# EAGLE design motors_motherBoard (EAGLE 8.2.0)
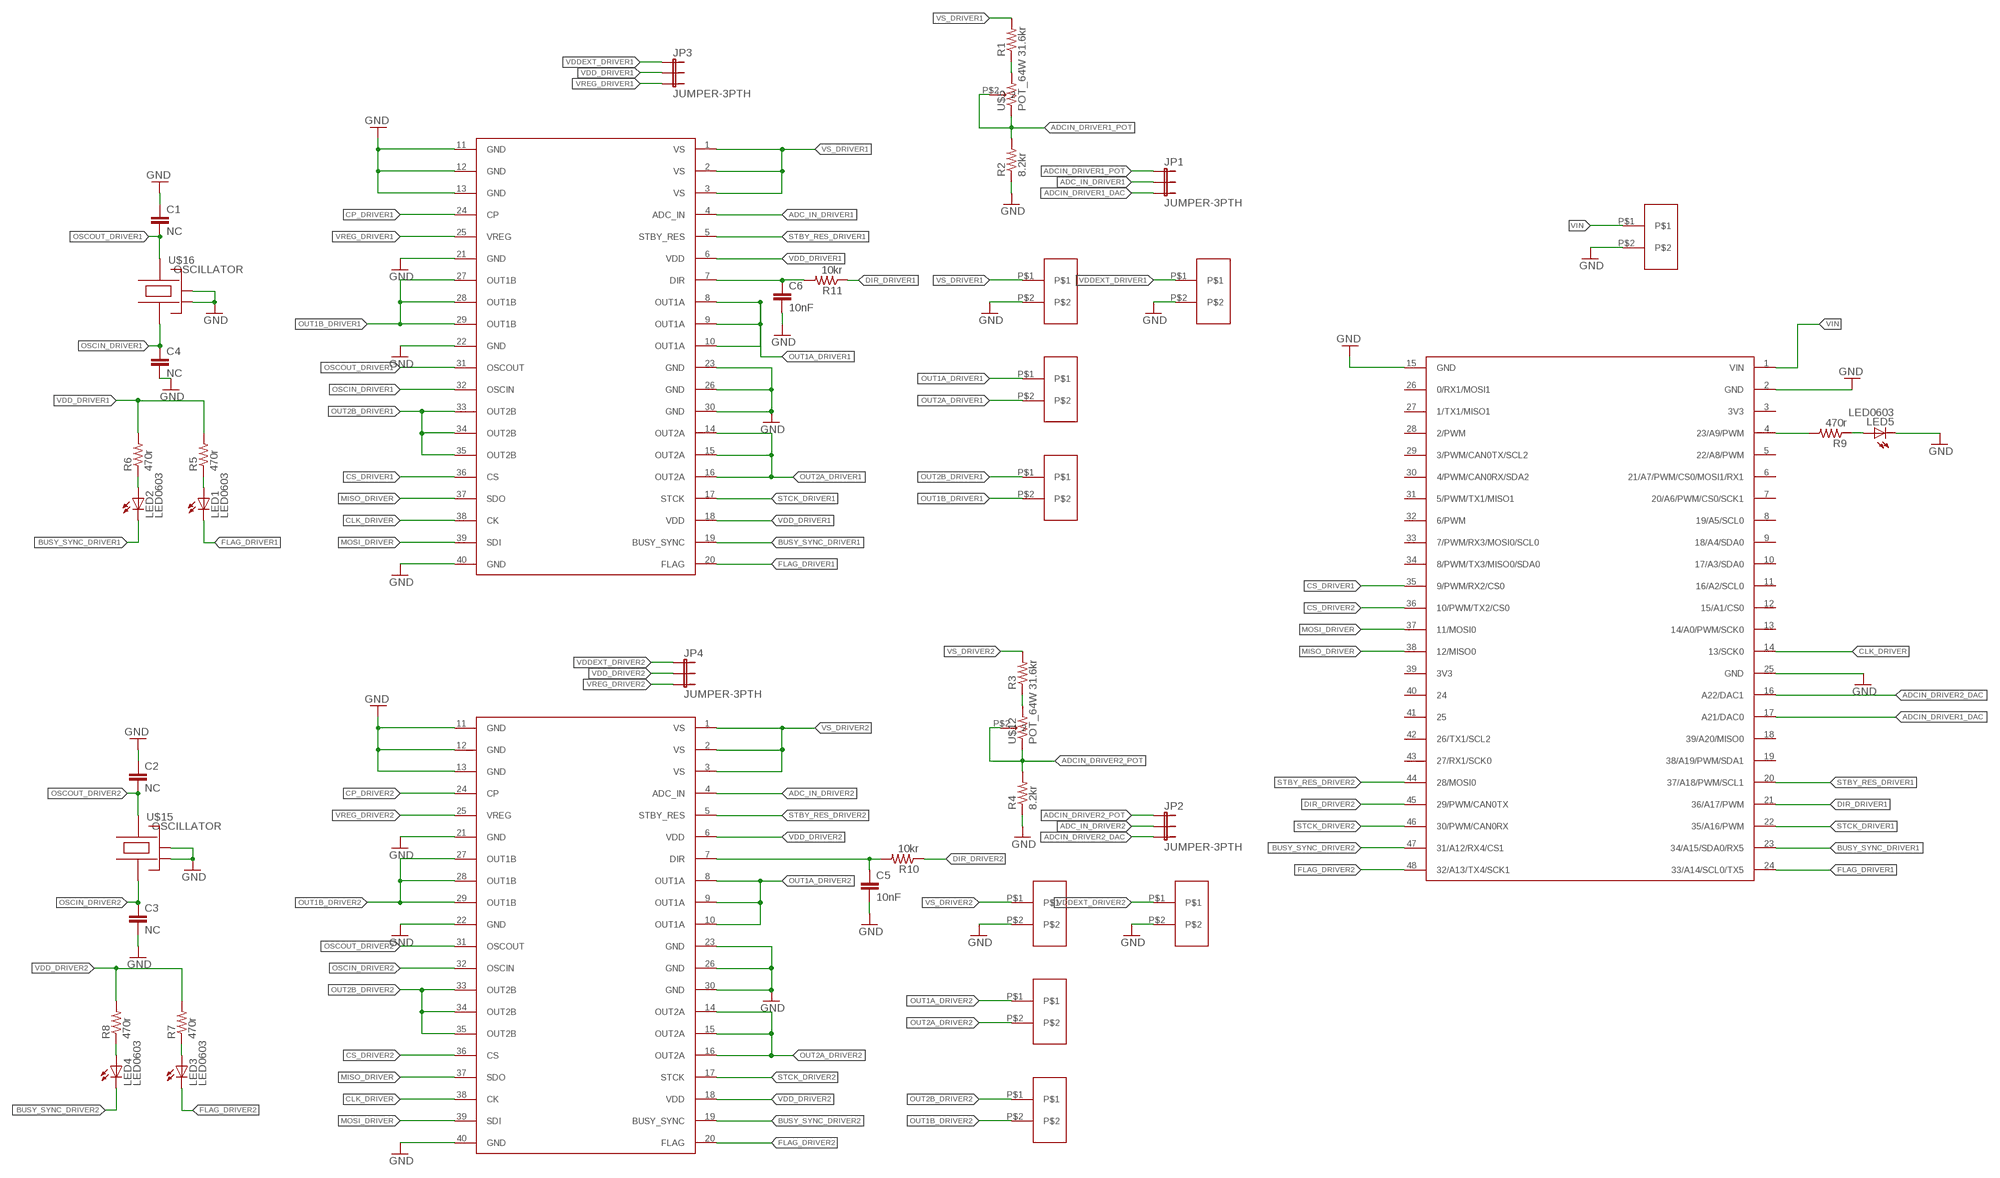
[diagram p0: schematic, sheet 1]

## Parts
C1  NC  CAP0603  [0603-CAP]
C2  NC  CAP0603  [0603-CAP]
C3  NC  CAP0603  [0603-CAP]
C4  NC  CAP0603  [0603-CAP]
C5  10nF  CAP0603  [0603-CAP]
C6  10nF  CAP0603  [0603-CAP]
JP1  JUMPER-3PTH  [1X03]
JP2  JUMPER-3PTH  [1X03]
JP3  JUMPER-3PTH  [1X03]
JP4  JUMPER-3PTH  [1X03]
LED1  LED0603  [0603-LED]
LED2  LED0603  [0603-LED]
LED3  LED0603  [0603-LED]
LED4  LED0603  [0603-LED]
LED5  LED0603  [0603-LED]
R1  31.6kr  RESISTOR0603-RES  [0603-RES]
R2  8.2kr  RESISTOR0603-RES  [0603-RES]
R3  31.6kr  RESISTOR0603-RES  [0603-RES]
R4  8.2kr  RESISTOR0603-RES  [0603-RES]
R5  470r  RESISTOR0603-RES  [0603-RES]
R6  470r  RESISTOR0603-RES  [0603-RES]
R7  470r  RESISTOR0603-RES  [0603-RES]
R8  470r  RESISTOR0603-RES  [0603-RES]
R9  470r  RESISTOR0603-RES  [0603-RES]
R10  10kr  RESISTOR0603-RES  [0603-RES]
R11  10kr  RESISTOR0603-RES  [0603-RES]
U$1  MOTORDRIVER_BASE_ADAPTER  [MOTORDRIVER_BASE_ADAPTER]
U$2  MOTORDRIVER_BASE_ADAPTER  [MOTORDRIVER_BASE_ADAPTER]
U$3  TEENSY_BASE_ADAPTER  [TEENSY_BASE_ADAPTER]
U$4  SCREW_CON_2POLES  [SCREW_CON_2POLES]
U$5  POT_64W  [POT_64W]
U$6  SCREW_CON_2POLES  [SCREW_CON_2POLES]
U$7  SCREW_CON_2POLES  [SCREW_CON_2POLES]
U$8  SCREW_CON_2POLES  [SCREW_CON_2POLES]
U$9  SCREW_CON_2POLES  [SCREW_CON_2POLES]
U$10  SCREW_CON_2POLES  [SCREW_CON_2POLES]
U$11  SCREW_CON_2POLES  [SCREW_CON_2POLES]
U$12  POT_64W  [POT_64W]
U$13  SCREW_CON_2POLES  [SCREW_CON_2POLES]
U$14  SCREW_CON_2POLES  [SCREW_CON_2POLES]
U$15  OSCILLATOR  [OSCILLATOR_3.2X2.5]
U$16  OSCILLATOR  [OSCILLATOR_3.2X2.5]

## Nets
ADC_IN_DRIVER1: JP1.2 U$2.4(ADC_IN)
ADC_IN_DRIVER2: JP2.2 U$1.4(ADC_IN)
ADCIN_DRIVER1_DAC: JP1.3 U$3.17(A21/DAC0)
ADCIN_DRIVER1_POT: JP1.1 R2.2 U$5.P$1 U$5.P$2
ADCIN_DRIVER2_DAC: JP2.3 U$3.16(A22/DAC1)
ADCIN_DRIVER2_POT: JP2.1 R4.2 U$12.P$1 U$12.P$2
BUSY_SYNC_DRIVER1: LED2.C U$2.19(BUSY_SYNC) U$3.23(34/A15/SDA0/RX5)
BUSY_SYNC_DRIVER2: LED4.C U$1.19(BUSY_SYNC) U$3.47(31/A12/RX4/CS1)
CLK_DRIVER: U$1.38(CK) U$2.38(CK) U$3.14(13/SCK0)
CP_DRIVER1: U$2.24(CP)
CP_DRIVER2: U$1.24(CP)
CS_DRIVER1: U$2.36(CS) U$3.35(9/PWM/RX2/CS0)
CS_DRIVER2: U$1.36(CS) U$3.36(10/PWM/TX2/CS0)
DIR_DRIVER1: R11.1 U$3.21(36/A17/PWM)
DIR_DRIVER2: R10.1 U$3.45(29/PWM/CAN0TX)
FLAG_DRIVER1: LED1.C U$2.20(FLAG) U$3.24(33/A14/SCL0/TX5)
FLAG_DRIVER2: LED3.C U$1.20(FLAG) U$3.48(32/A13/TX4/SCK1)
GND: C1.P$1 C2.P$1 C3.P$2 C4.P$2 C5.P$2 C6.P$2 LED5.C R2.1 R4.1 U$1.11(GND) U$1.12(GND) U$1.13(GND) U$1.21(GND) U$1.22(GND) U$1.23(GND) U$1.26(GND) U$1.30(GND) U$1.40(GND) U$2.11(GND) U$2.12(GND) U$2.13(GND) U$2.21(GND) U$2.22(GND) U$2.23(GND) U$2.26(GND) U$2.30(GND) U$2.40(GND) U$3.2(GND) U$3.15(GND) U$3.25(GND) U$7.P$2 U$9.P$2 U$11.P$2 U$13.P$2 U$14.P$2 U$15.2(GND) U$15.4(GND) U$16.2(GND) U$16.4(GND)
MISO_DRIVER: U$1.37(SDO) U$2.37(SDO) U$3.38(12/MISO0)
MOSI_DRIVER: U$1.39(SDI) U$2.39(SDI) U$3.37(11/MOSI0)
N$1: R3.1 U$12.P$3
N$2: R1.1 U$5.P$3
N$3: LED2.A R6.1
N$4: LED1.A R5.1
N$5: LED4.A R8.1
N$6: LED3.A R7.1
N$7: LED5.A R9.1
N$8: R9.2 U$3.4(23/A9/PWM)
N$9: C6.P$1 R11.2 U$2.7(DIR)
N$10: C5.P$1 R10.2 U$1.7(DIR)
OSCIN_DRIVER1: C4.P$1 U$2.32(OSCIN) U$16.1
OSCIN_DRIVER2: C3.P$1 U$1.32(OSCIN) U$15.1
OSCOUT_DRIVER1: C1.P$2 U$2.31(OSCOUT) U$16.3
OSCOUT_DRIVER2: C2.P$2 U$1.31(OSCOUT) U$15.3
OUT1A_DRIVER1: U$2.8(OUT1A) U$2.9(OUT1A) U$2.10(OUT1A) U$6.P$1
OUT1A_DRIVER2: U$1.8(OUT1A) U$1.9(OUT1A) U$1.10(OUT1A) U$4.P$1
OUT1B_DRIVER1: U$2.27(OUT1B) U$2.28(OUT1B) U$2.29(OUT1B) U$8.P$2
OUT1B_DRIVER2: U$1.27(OUT1B) U$1.28(OUT1B) U$1.29(OUT1B) U$10.P$2
OUT2A_DRIVER1: U$2.14(OUT2A) U$2.15(OUT2A) U$2.16(OUT2A) U$6.P$2
OUT2A_DRIVER2: U$1.14(OUT2A) U$1.15(OUT2A) U$1.16(OUT2A) U$4.P$2
OUT2B_DRIVER1: U$2.33(OUT2B) U$2.34(OUT2B) U$2.35(OUT2B) U$8.P$1
OUT2B_DRIVER2: U$1.33(OUT2B) U$1.34(OUT2B) U$1.35(OUT2B) U$10.P$1
STBY_RES_DRIVER1: U$2.5(STBY_RES) U$3.20(37/A18/PWM/SCL1)
STBY_RES_DRIVER2: U$1.5(STBY_RES) U$3.44(28/MOSI0)
STCK_DRIVER1: U$2.17(STCK) U$3.22(35/A16/PWM)
STCK_DRIVER2: U$1.17(STCK) U$3.46(30/PWM/CAN0RX)
VDD_DRIVER1: JP3.2 R5.2 R6.2 U$2.6(VDD) U$2.18(VDD)
VDD_DRIVER2: JP4.2 R7.2 R8.2 U$1.6(VDD) U$1.18(VDD)
VDDEXT_DRIVER1: JP3.1 U$13.P$1
VDDEXT_DRIVER2: JP4.1 U$11.P$1
VIN: U$3.1(VIN) U$14.P$1
VREG_DRIVER1: JP3.3 U$2.25(VREG)
VREG_DRIVER2: JP4.3 U$1.25(VREG)
VS_DRIVER1: R1.2 U$2.1(VS) U$2.2(VS) U$2.3(VS) U$7.P$1
VS_DRIVER2: R3.2 U$1.1(VS) U$1.2(VS) U$1.3(VS) U$9.P$1
Unconnected: U$3.3(3V3) U$3.5(22/A8/PWM) U$3.6(21/A7/PWM/CS0/MOSI1/RX1) U$3.7(20/A6/PWM/CS0/SCK1) U$3.8(19/A5/SCL0) U$3.9(18/A4/SDA0) U$3.10(17/A3/SDA0) U$3.11(16/A2/SCL0) U$3.12(15/A1/CS0) U$3.13(14/A0/PWM/SCK0) U$3.18(39/A20/MISO0) U$3.19(38/A19/PWM/SDA1) U$3.26(0/RX1/MOSI1) U$3.27(1/TX1/MISO1) U$3.28(2/PWM) U$3.29(3/PWM/CAN0TX/SCL2) U$3.30(4/PWM/CAN0RX/SDA2) U$3.31(5/PWM/TX1/MISO1) U$3.32(6/PWM) U$3.33(7/PWM/RX3/MOSI0/SCL0) U$3.34(8/PWM/TX3/MISO0/SDA0) U$3.39(3V3) U$3.40 U$3.41 U$3.42(26/TX1/SCL2) U$3.43(27/RX1/SCK0)

## Library data of the parts
C1-C6 = Usefull_ICs:CAP: Capacitor Standard 0603 ceramic capacitor, and 0.1" leaded capacitor.
JP1-JP4 = Usefull_ICs:JUMPER-3
LED1-LED5 = Usefull_ICs:LED: LEDs Standard schematic elements and footprints for 5mm, 3mm, 1206, and 0603 sized LEDs. 5mm - Spark Fun Electronics SKU : COM-00529 (and others)
R1-R11 = Usefull_ICs:RESISTOR: Resistor Basic schematic elements and footprints for 0603, 1206, and PTH 1/10th watt (small) resistors.
U$1 U$2 = Usefull_ICs:MOTORDRIVER_BASE_ADAPTER
U$3 = Usefull_ICs:TEENSY_BASE_ADAPTER
U$4 U$6-U$11 U$13 U$14 = Usefull_ICs:SCREW_CON_2POLES
U$5 U$12 = Usefull_ICs:POT_64W
U$15 U$16 = Usefull_ICs:OSCILLATOR

## Board
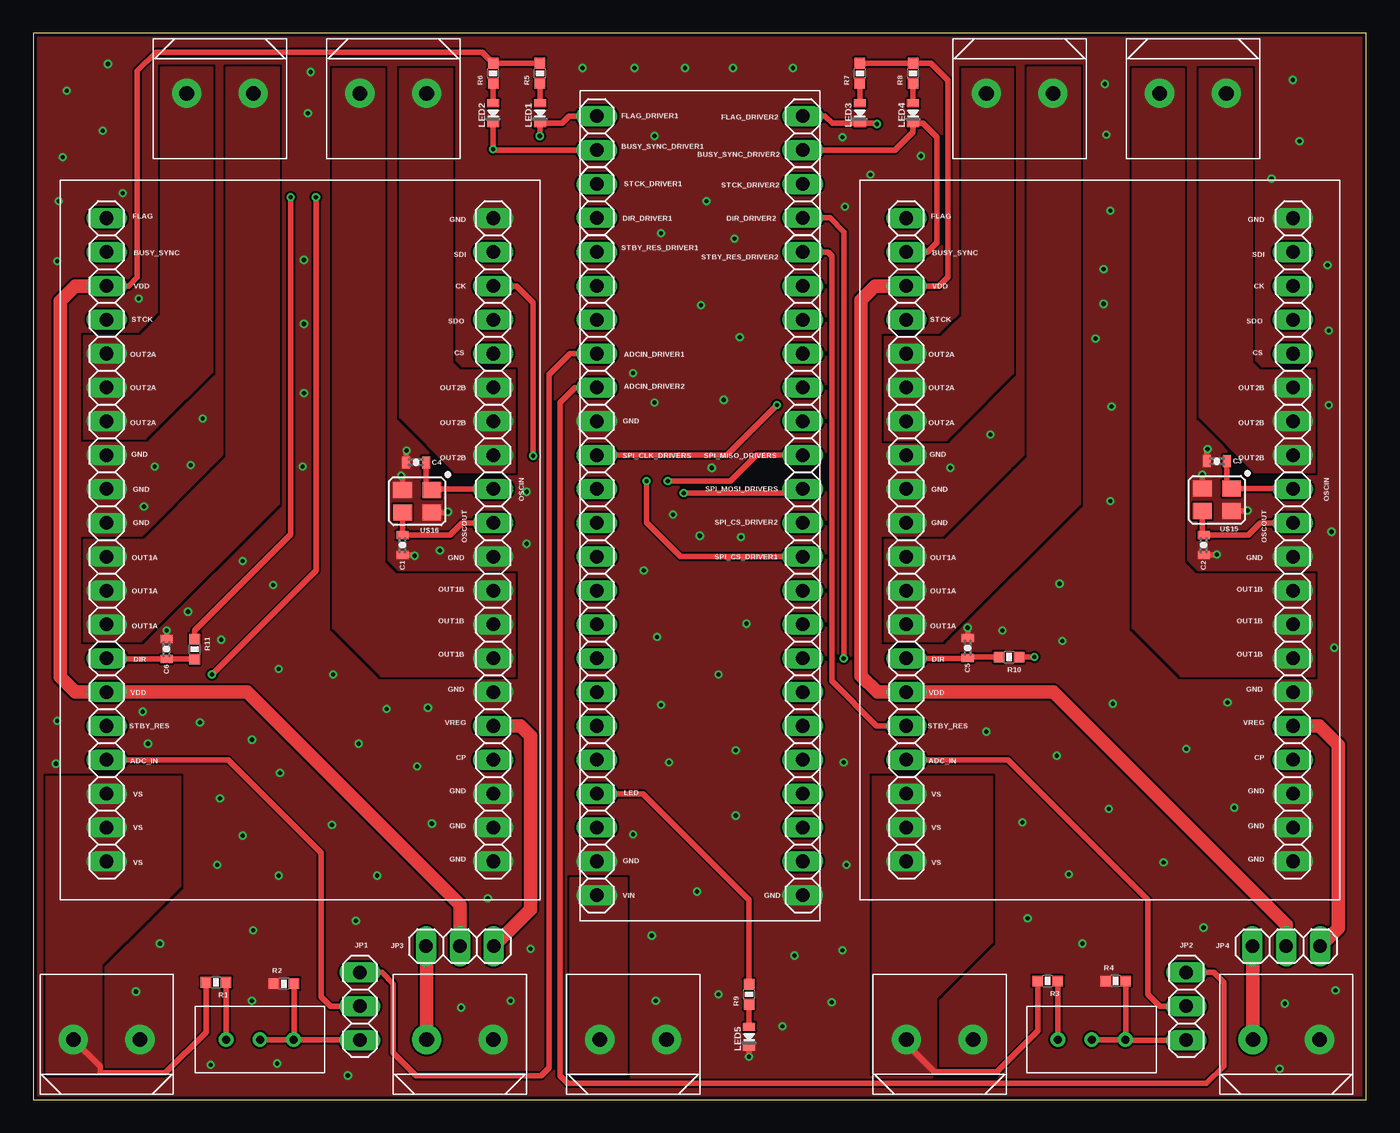
[diagram p1: board, top side]
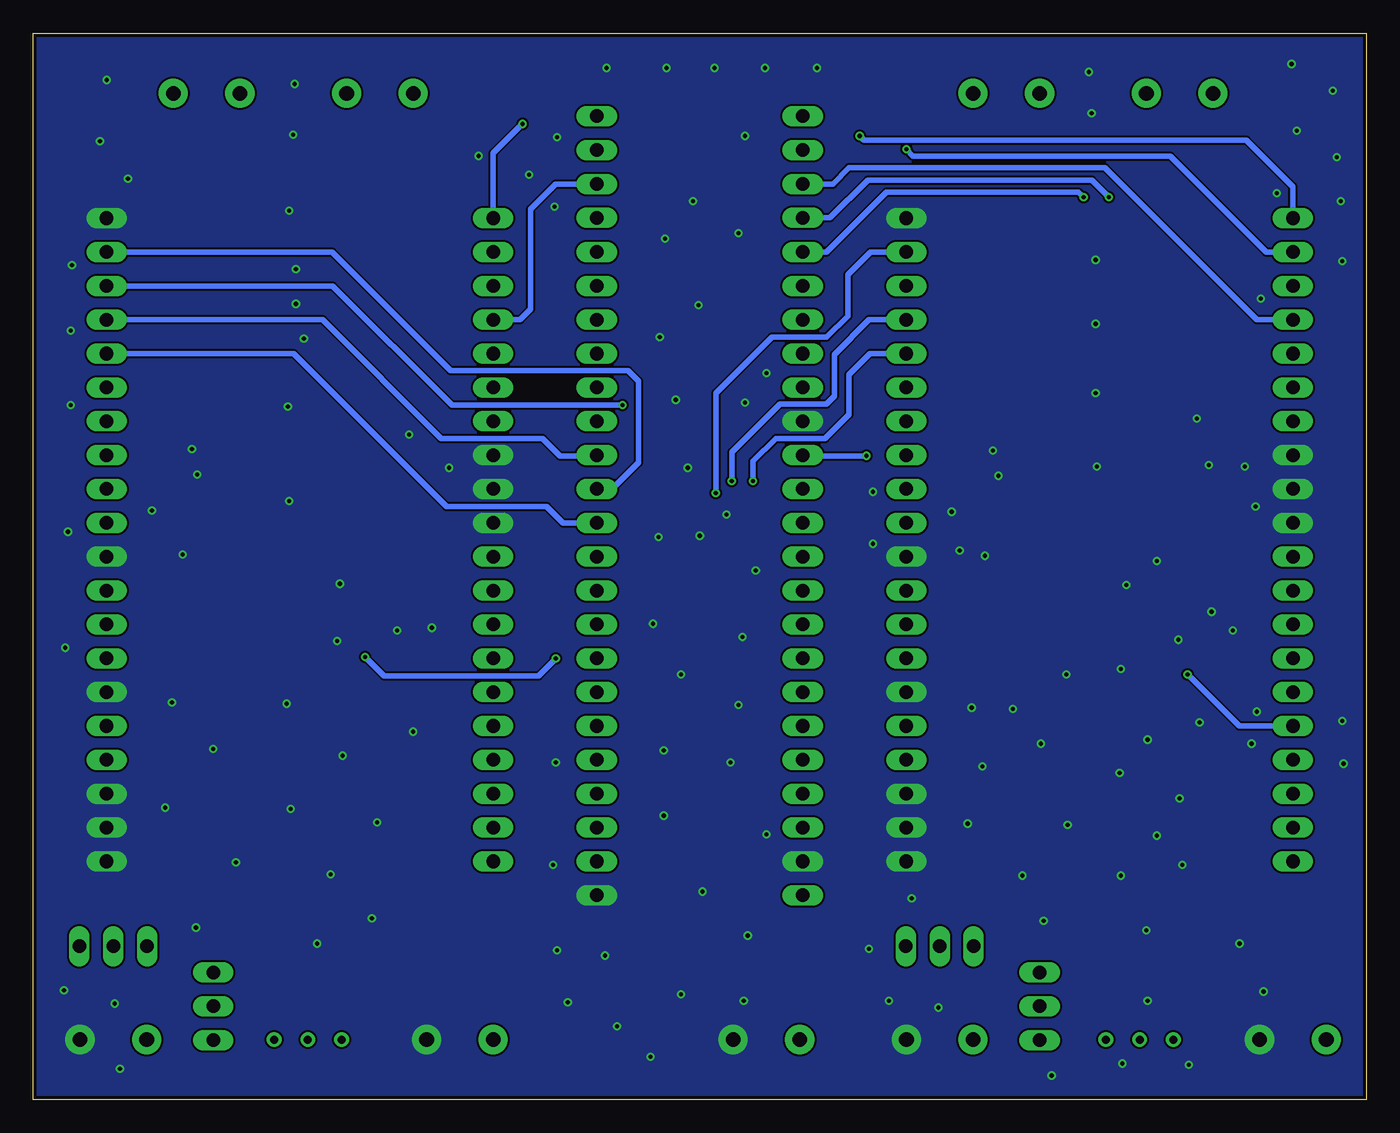
[diagram p2: board, bottom side, seen from below]

Size 100 x 80 mm. Coordinates in mm from the lower left corner, seen from the top.
Outline: 0,0 100,0 100,80 0,80 0,0
Copper layers (1*16): Top 0.035mm / dielectric 1.5mm / Bottom 0.035mm
Design rules "SeeedStudio_2layer_DRU_no_angle_20140221": minimum track width 6mil, minimum drill 12mil, track to track 6mil, track to pad 6mil, pad to pad 6mil, via to via 6mil, smd to smd 0mil, copper to edge 10mil, drill to drill 10mil, minimum pad ring 10mil, minimum via ring 6mil, stop-mask expansion 2mil, vias tented up to drill 100mil, thermal gap 10mil

### Footprints (pad centres in the part's own frame; a part is rotated, then mirrored left to right if it is on the bottom)
0603-CAP = smd 0.6 x 0.9: P$1 -0.75,0; P$2 0.75,0
1X03 = drill 1.016 long: 1 -2.54,0; 2 0,0; 3 2.54,0
0603-LED = smd 0.6 x 0.9: A 0.75,0; C -0.75,0
0603-RES = smd 0.8 x 0.8: 1 -0.75,0; 2 0.75,0
MOTORDRIVER_BASE_ADAPTER = drill 1.016 long: 1 -24.13,14.5; 2 -21.59,14.5; 3 -19.05,14.5; 4 -16.51,14.5; 5 -13.97,14.5; 6 -11.43,14.5; 7 -8.89,14.5; 8 -6.35,14.5; 9 -3.81,14.5; 10 -1.27,14.5; 11 1.27,14.5; 12 3.81,14.5; 13 6.35,14.5; 14 8.89,14.5; 15 11.43,14.5; 16 13.97,14.5; 17 16.51,14.5; 18 19.05,14.5; 19 21.59,14.5; 20 24.13,14.5; 21 -24.13,-14.5; 22 -21.59,-14.5; 23 -19.05,-14.5; 24 -16.51,-14.5; 25 -13.97,-14.5; 26 -11.43,-14.5; 27 -8.89,-14.5; 28 -6.35,-14.5; 29 -3.81,-14.5; 30 -1.27,-14.5; 31 1.27,-14.5; 32 3.81,-14.5; 33 6.35,-14.5; 34 8.89,-14.5; 35 11.43,-14.5; 36 13.97,-14.5; 37 16.51,-14.5; 38 19.05,-14.5; 39 21.59,-14.5; 40 24.13,-14.5
TEENSY_BASE_ADAPTER = drill 1.016 long: 1 -29.21,7.73; 2 -26.67,7.73; 3 -24.13,7.73; 4 -21.59,7.73; 5 -19.05,7.73; 6 -16.51,7.73; 7 -13.97,7.73; 8 -11.43,7.73; 9 -8.89,7.73; 10 -6.35,7.73; 11 -3.81,7.73; 12 -1.27,7.73; 13 1.27,7.73; 14 3.81,7.73; 15 6.35,7.73; 16 8.89,7.73; 17 11.43,7.73; 18 13.97,7.73; 19 16.51,7.73; 20 19.05,7.73; 21 21.61,7.73; 22 24.15,7.73; 23 26.71,7.73; 24 29.25,7.73; 25 -29.21,-7.73; 26 -26.67,-7.73; 27 -24.13,-7.73; 28 -21.59,-7.73; 29 -19.05,-7.73; 30 -16.51,-7.73; 31 -13.97,-7.73; 32 -11.43,-7.73; 33 -8.89,-7.73; 34 -6.35,-7.73; 35 -3.81,-7.73; 36 -1.27,-7.73; 37 1.27,-7.73; 38 3.81,-7.73; 39 6.35,-7.73; 40 8.89,-7.73; 41 11.43,-7.73; 42 13.97,-7.73; 43 16.51,-7.73; 44 19.05,-7.73; 45 21.61,-7.73; 46 24.15,-7.73; 47 26.71,-7.73; 48 29.25,-7.73
SCREW_CON_2POLES = drill 1.1 pad 2.184: P$1 -2.5,0; P$2 2.5,0
POT_64W = drill 0.6: P$1 -2.54,0; P$2 0,0; P$3 2.54,0
OSCILLATOR_3.2X2.5 = smd 1.4 x 1.2: 1 -1.1,-0.85; 2 1.1,-0.85; 3 1.1,0.85; 4 -1.1,0.85

### Placement (x,y rotation side)
C1  27.7,41.6 90 top
C2  87.8,41.6 90 top
C3  88.8,47.9 180 top
C4  28.7,47.8 180 top
C5  70.1,33.9 90 top
C6  10,33.8 90 top
JP1  24.5,7 90 top
JP2  86.5,7 90 top
JP3  32,11.5 0 top
JP4  94,11.5 0 top
LED1  38,74 90 top
LED2  34.5,74 90 top
LED3  62,74 90 top
LED4  66,74 90 top
LED5  53.7,4.7 90 top
R1  13.7,8.8 180 top
R2  18.8,8.7 0 top
R3  76.1,8.9 180 top
R4  81.2,8.9 0 top
R5  38,77 90 top
R6  34.5,77 90 top
R7  62,77 90 top
R8  66,77 90 top
R9  53.7,7.9 90 top
R10  73.2,33.2 180 top
R11  12.1,33.8 270 top
U$1  80,42 90 top
U$2  20,42 90 top
U$3  50,44.54 90 top
U$4  74,75.5 180 top
U$5  17,4.5 180 top
U$6  14,75.5 180 top
U$7  5.5,4.5 0 top
U$8  27,75.5 180 top
U$9  68,4.5 0 top
U$10  87,75.5 180 top
U$11  94,4.5 0 top
U$12  79.4,4.5 180 top
U$13  32,4.5 0 top
U$14  45,4.5 0 top
U$15  88.8,45 180 top
U$16  28.8,44.9 180 top

### Tracks (layer width: path | path; a pad name or v marks a point on that pad's centre or on a via)
ADC_IN_DRIVER1
  Top 0.4: JP1.2 22.3,7 21.6,7.7 21.6,18.5 14.61,25.49 U$2.4
ADC_IN_DRIVER2
  Top 0.4: JP2.2 84.5,7 83.6,7.9 83.6,12.6 83.6,15 73.11,25.49 U$1.4
ADCIN_DRIVER1_DAC
  Top 0.4: JP1.3 26.16,9.54 27,8.7 27,3.5 28.7,1.8 38.1,1.8 38.7,2.4 38.7,54.4 40.27,55.97 U$3.17
ADCIN_DRIVER1_POT
  Top 0.4: U$5.P$1 R2.2 | U$5.P$2 U$5.P$1 | U$5.P$1 24.46,4.5 JP1.1
ADCIN_DRIVER2_DAC
  Top 0.4: JP2.3 88.56,9.54 89.3,8.8 89.3,2.5 88.02,1.22 40.08,1.22 39.5,1.8 39.5,52.3 40.63,53.43 U$3.16
ADCIN_DRIVER2_POT
  Top 0.4: R4.2 U$12.P$1 | U$12.P$1 U$12.P$2 | U$12.P$1 82,4.46 JP2.1
BUSY_SYNC_DRIVER1  (via drill 0.3)
  Top 0.4: LED2.C v34.5,71.3 34.55,71.25 U$3.23
  Bottom 0.4: v34.5,71.3 34,70.8 14.7,70.8 7.49,63.59 U$2.19
BUSY_SYNC_DRIVER2
  Top 0.4: U$3.47 64.65,71.25 66,72.6 LED4.C 66.75,73.25 67.8,72.2 67.8,64.3 67.09,63.59 U$1.19
CLK_DRIVER  (via drill 0.3)
  Top 0.4: U$2.38 36.25,61.05 37.5,59.8 v37.5,48.3 | v55.8,52.1 52.05,48.35 U$3.14
  Bottom 0.4: v37.5,48.3 42.22,48.3 U$3.14 | U$1.38 77.55,61.05 68.6,52.1 v55.8,52.1
CS_DRIVER1  (via drill 0.3)
  Top 0.4: v46,46.4 46,43.3 48.57,40.73 U$3.35
  Bottom 0.4: U$2.36 37.23,55.97 38.8,54.4 38.8,51.4 40.6,49.6 44.3,49.6 46,47.9 v46,46.4
CS_DRIVER2
  Bottom 0.4: U$1.36 80.47,55.97 69,44.5 61.5,44.5 60.27,43.27 U$3.36
DIR_DRIVER1  (via drill 0.3)
  Top 0.4: R11.1 12.1,35.2 19.3,42.4 v19.3,67.7
  Bottom 0.4: U$3.21 40.25,66.15 37.4,69 20.6,69 v19.3,67.7
DIR_DRIVER2  (via drill 0.3)
  Top 0.4: U$3.45 59.75,66.15 60.8,65.1 v60.8,33.1 | v75.1,33.2 R10.1
  Bottom 0.4: v60.8,33.1 62.1,31.8 73.7,31.8 v75.1,33.2
FLAG_DRIVER1  (via drill 0.3)
  Top 0.4: U$3.24 40.19,73.79 39.65,73.25 LED1.C v38,72.3
  Bottom 0.4: U$2.20 5.5,68.5 9,72 37.7,72 v38,72.3
FLAG_DRIVER2  (via drill 0.3)
  Top 0.4: U$3.48 59.41,73.79 59.95,73.25 LED3.C 63.25,73.25 v63.3,73.2
  Bottom 0.4: v63.3,73.2 65.5,71 U$1.20
GND  (via drill 0.3)
  Top 0.4: C1.P$1 28.55,40.85 v28.6,40.8 | C4.P$2 27.95,48.65 v28,48.7 | C3.P$2 88.05,48.75 v88.1,48.8 | C2.P$1 88.75,40.85 v88.8,40.9 | LED5.C v53.7,3.2 | U$16.2 27.7,46.7 v27.6,46.8 | U$16.4 31.05,44.05 v31.1,44.1 | U$15.4 91.05,44.15 v91.1,44.2 | U$15.2 v87.7,46.9 | C5.P$2 v70.1,35.4 | C6.P$2 v10,35.2
  other vias: 41.2,77.4 45.1,77.4 48.9,77.4 52.5,77.4 57,77.4 46.6,72.3 50.5,67.4 47.1,65 50.1,59.6 51.8,52.5 52.6,64.6 53,57.2 46.6,52.3 53.1,42.2 45.8,39.7 53.5,35.7 46.8,34.7 51.4,31.9 47.1,29.6 52.7,26.2 47.7,25.3 52.7,21.3 45,19.9 49.8,15.6 46.4,12.3 51.4,7.9 57.1,10.8 56.2,5.5 59.9,7.3 61,17.6 60.8,25.3 71.5,27.6 76.8,25.8 80.7,21.8 84.8,17.8 74.2,20.8 77.7,16.9 74.6,13.6 78.7,11.7 72.7,35.2 77,38.7 77.2,34.4 81,29.7 89.6,29.8 86.5,26.3 90.1,21.9 80.9,52 80.8,44.9 68.8,47.4 71.8,49.9 80.4,76.2 80.5,72.4 80.8,66.7 94.5,76.5 95,71.9 97.1,62.6 97.6,33.9 97.4,42.6 97.2,52.1 97.2,57.7 29.9,20.7 29.6,29.4 28.8,25 26.5,29.3 24.4,26.7 22.5,31.9 18.4,32.3 11.6,36.6 15.7,40.4 18,38.6 14.1,34.5 8.2,29.1 8.6,26.7 12.5,28.3 16.4,27 18.5,24.5 22.4,20.6 25.8,16.8 18.4,16.8 14,22.6 13.8,17.6 15.7,19.8 9.5,11.7 16.5,12.7 1.7,25.2 1.8,28.4 1.8,62.9 1.9,67.4 5.6,77.7 2.5,75.7 5.2,72.7 2.2,70.7 6.7,68 7.9,60.1 20.8,77.1 20.6,74 20.3,63 20.3,58.2 20.3,53 20.2,47.5 12.7,51.1 11.8,47.6 9.1,47.5 8.3,44.5 30.5,41.2 37,45.6 37,41.7 32.1,6.9 37.3,11.3 34.1,15.1 46.7,7.4 35.8,7.4 24.2,13.4 7.7,8.1 13.3,2.6 16.4,7.4 18.3,2.7 23.6,1.8 93.9,7.2 97.7,8.2 93.5,2.3 87.8,12.9 80.3,62.3 80.3,59.7 79.7,57.1 92.9,69.1 62.8,69.4 66.6,70.8 60.7,72.2 60.9,67 50.9,47.4 45,54.5 48,43.9 50,42.3 60.7,11.2
  pour Top (rank 2, no thermals): -1.1,13.6 -1.1,80.7 99.6,80.7 101.1,80.7 101.1,1 101.1,-0.7 0.1,-0.7 -1.1,-0.7
  pour Bottom (rank 2, no thermals): 101.6,13.6 101.6,80.7 0.9,80.7 -0.6,80.7 -0.6,1 -0.6,-0.7 100.4,-0.7 101.6,-0.7
MISO_DRIVER  (via drill 0.3)
  Top 0.4: v47.6,46.4 52.3,46.4 54.25,48.35 U$3.38
  Bottom 0.4: U$2.37 37.29,58.51 39.9,55.9 39.9,52.8 40.5,52.2 44,52.2 47.6,48.6 v47.6,46.4 | U$1.37 78.31,58.51 69.4,49.6 61.8,49.6 60.5,48.3 57.78,48.3 U$3.38
MOSI_DRIVER  (via drill 0.3)
  Top 0.4: v48.8,45.5 57.4,45.5 57.71,45.81 U$3.37
  Bottom 0.4: U$2.39 37.21,63.59 38.9,61.9 38.9,58.8 40.5,57.2 44.6,57.2 48.8,53 v48.8,45.5 | U$1.39 77.59,63.59 68.7,54.7 55.4,54.7 54.6,53.9 54.6,47.8 56.59,45.81 U$3.37
N$1
  Top 0.4: R3.1 U$12.P$3
N$2
  Top 0.4: U$5.P$3 R1.1
N$3
  Top 0.4: R6.1 LED2.A
N$4
  Top 0.4: R5.1 LED1.A
N$5
  Top 0.4: R8.1 LED4.A
N$6
  Top 0.4: R7.1 LED3.A
N$7
  Top 0.4: R9.1 LED5.A
N$8
  Top 0.4: U$3.4 45.75,22.95 53.7,15 R9.2
N$9
  Top 0.4: R11.2 C6.P$1 5.56,33.05 U$2.7
N$10
  Top 0.4: 70.15,33.2 R10.2 | 70.15,33.2 C5.P$1 | U$1.7 70.06,33.11 70.15,33.2
OSCIN_DRIVER1
  Top 0.4: U$2.32 29.96,45.81 U$16.1 29.45,46.2 C4.P$1
OSCIN_DRIVER2
  Top 0.4: U$1.32 94.46,45.85 U$15.1 89.55,46.2 C3.P$1
OSCOUT_DRIVER1
  Top 0.4: U$16.3 C1.P$2 31.25,42.35 32.17,43.27 U$2.31
OSCOUT_DRIVER2
  Top 0.4: U$15.3 87.7,42.45 C2.P$2 91.15,42.35 92.07,43.27 U$1.31
OUT1A_DRIVER1
  pour Top (no thermals): 14.5,75.5 14.5,77.4 17.1,77.4 18.4,77.4 18.4,74.6 18.4,44.7 8.4,34.7 8.1,34.4 4.9,34.4 3.8,34.4 3.8,38.1 3.8,42 7.6,42 8.3,42 13.5,47.2 14.5,48.2
OUT1A_DRIVER2
  pour Top (no thermals): 74.6,75.5 74.6,77.4 77.2,77.4 78.5,77.4 78.5,74.6 78.5,44.7 68.5,34.7 68.2,34.4 65,34.4 63.9,34.4 63.9,38.1 63.9,42 67.7,42 68.4,42 73.6,47.2 74.6,48.2
OUT1B_DRIVER1
  pour Top (no thermals): 36.1,39.4 27.2,39.4 26.3,40.3 26.3,77.3 22.5,77.3 22.5,35.4 26.1,31.8 36.1,31.8
OUT1B_DRIVER2
  pour Top (no thermals): 96.1,39.4 87.2,39.4 86.3,40.3 86.3,77.3 82.5,77.3 82.5,35.4 86.1,31.8 96.1,31.8
OUT2A_DRIVER1
  pour Top (no thermals): 4.7,57.3 8,57.3 8.9,58.2 9.6,58.9 9.6,77.4 12.9,77.4 13.4,77.4 13.4,73.5 13.4,54.6 9.3,50.5 8.4,49.6 5.9,49.6 3.8,49.6 3.8,56.7 3.8,57.3
OUT2A_DRIVER2
  pour Top (no thermals): 64.8,57.2 68.1,57.2 69,58.1 69.7,58.8 69.7,77.3 73,77.3 73.5,77.3 73.5,73.4 73.5,54.5 69.4,50.4 68.5,49.5 66,49.5 63.9,49.5 63.9,56.6 63.9,57.2
OUT2B_DRIVER1
  pour Top (no thermals): 36.1,54.7 32,54.7 31.4,55.3 31.4,77.3 27.5,77.3 27.5,51.2 31.6,47.1 36.1,47.1
OUT2B_DRIVER2
  pour Top (no thermals): 96.1,54.7 92,54.7 91.4,55.3 91.4,77.3 87.5,77.3 87.5,51.2 91.6,47.1 96.1,47.1
STBY_RES_DRIVER1  (via drill 0.3)
  Top 0.4: v21.2,67.7 21.2,39.7 v13.4,31.9
  Bottom 0.4: U$3.20 40.51,63.59 36,68.1 21.6,68.1 v21.2,67.7 | v13.4,31.9 9.53,28.03 U$2.5
STBY_RES_DRIVER2
  Top 0.4: U$3.44 59.61,63.59 59.9,63.3 59.9,31.4 63.27,28.03 U$1.5
STCK_DRIVER1
  Bottom 0.4: U$2.17 8.21,58.51 19.6,69.9 38.8,69.9 40.01,68.69 U$3.22
STCK_DRIVER2
  Bottom 0.4: U$1.17 63.49,58.51 62.7,59.3 62.7,66.8 60.81,68.69 U$3.46
VDD_DRIVER1
  Top 0.4: U$2.18 7.15,61.05 7.8,61.7 7.8,77.2 9.2,78.6 33.65,78.6 R6.2 R5.2
  Top 1: JP3.2 32,14.6 16.03,30.57 U$2.6 3.13,30.57 2,31.7 2,59.9 3.15,61.05 U$2.18
VDD_DRIVER2
  Top 0.4: U$1.18 67.95,61.05 68.6,61.7 68.6,76.5 67.35,77.75 R8.2 R7.2
  Top 1: JP4.2 94,13.1 76.53,30.57 U$1.6 63.33,30.57 62.1,31.8 62.1,60 63.15,61.05 U$1.18
VDDEXT_DRIVER1
  Top 1: U$13.P$1 29.5,11.46 JP3.1
VDDEXT_DRIVER2
  Top 1: U$11.P$1 91.5,11.46 JP4.1
VIN
  pour Top (no thermals): 40.3,16.6 44.5,16.6 44.5,1.9 40.3,1.9
VREG_DRIVER1
  Top 1: JP3.3 37.3,14.26 37.3,27.3 36.57,28.03 U$2.25
VREG_DRIVER2
  Top 1: JP4.3 97.9,12.86 97.9,26.6 96.47,28.03 U$1.25
VS_DRIVER1
  Top 0.4: R1.2 12.95,5.05 9.9,2 5,2 5,2.5 U$7.P$1
  pour Top (no thermals): 5.2,24.2 1,24.2 1,5.2 1,1.9 2.7,1.9 5.1,1.9 5.1,5.1 5.1,10.1 8.6,13.6 11,16 11,24 11,24.2
VS_DRIVER2
  Top 0.4: R3.2 75.35,5.15 72.3,2.1 67.6,2.1 65.5,4.2 U$9.P$1
  pour Top (no thermals): 63,2.3 63,24.2 66.9,24.2 71.9,24.2 71.9,16.2 71.9,11.8 68,7.9 67.7,7.6 67.7,4.7 67.7,2 63.3,2 63,2

### Text on the board
tNames: FLAG_DRIVER1 | FLAG_DRIVER2 | BUSY_SYNC_DRIVER1 | BUSY_SYNC_DRIVER2 | STCK_DRIVER1 | STCK_DRIVER2 | FLAG | GND | DIR_DRIVER1 | DIR_DRIVER2 | FLAG | GND | BUSY_SYNC | SDI | STBY_RES_DRIVER1 | BUSY_SYNC | SDI | STBY_RES_DRIVER2 | VDD | CK | VDD | CK | STCK | SDO | STCK | SDO | OUT2A | CS | ADCIN_DRIVER1 | OUT2A | CS | OUT2A | OUT2B | OUT2A | OUT2B | ADCIN_DRIVER2 | OUT2A | OUT2B | GND | OUT2A | OUT2B | GND | GND | OUT2B | SPI_CLK_DRIVERS | SPI_MISO_DRIVERS | OUT2B | OSCIN | OSCIN | GND | SPI_MOSI_DRIVERS | GND | OSCOUT | OSCOUT | GND | SPI_CS_DRIVER2 | GND | OUT1A | GND | OUT1A | GND | SPI_CS_DRIVER1 | OUT1A | OUT1B | OUT1A | OUT1B | OUT1A | OUT1B | OUT1A | OUT1B | OUT1B | OUT1B | DIR | DIR | VDD | GND | VDD | GND | STBY_RES | VREG | STBY_RES | VREG | ADC_IN | CP | ADC_IN | CP | VS | GND | LED | VS | GND | VS | GND | VS | GND | VS | GND | GND | VS | GND | VIN | GND